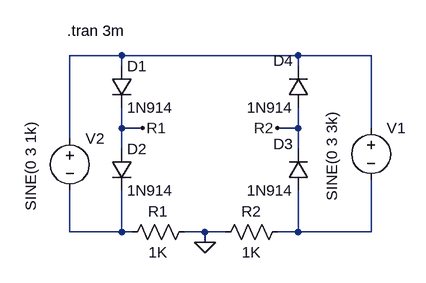
[diagram p0: schematic FullDuplex.asc]
FullDuplex.asc, the LTspice schematic file:
Version 4
SHEET 1 880 680
WIRE -128 208 -128 80
WIRE -128 352 -128 288
WIRE -48 80 -128 80
WIRE -48 96 -48 80
WIRE -48 192 -48 160
WIRE -48 224 -48 192
WIRE -48 352 -128 352
WIRE -48 352 -48 288
WIRE -32 352 -48 352
WIRE -16 192 -48 192
WIRE 80 352 48 352
WIRE 80 368 80 352
WIRE 112 352 80 352
WIRE 224 80 -48 80
WIRE 224 96 224 80
WIRE 224 192 192 192
WIRE 224 192 224 160
WIRE 224 224 224 192
WIRE 224 352 192 352
WIRE 224 352 224 288
WIRE 336 80 224 80
WIRE 336 192 336 80
WIRE 336 352 224 352
WIRE 336 352 336 272
FLAG 80 368 0
FLAG -16 192 R1
FLAG 192 192 R2
SYMBOL diode -64 96 R0
SYMATTR InstName D1
SYMATTR Value 1N914
SYMBOL diode -64 224 R0
SYMATTR InstName D2
SYMATTR Value 1N914
SYMBOL diode 240 288 R180
WINDOW 0 24 72 Left 0
WINDOW 3 24 0 Left 0
SYMATTR InstName D3
SYMATTR Value 1N914
SYMBOL diode 240 160 R180
WINDOW 0 24 72 Left 0
WINDOW 3 24 0 Left 0
SYMATTR InstName D4
SYMATTR Value 1N914
SYMBOL res 64 336 R90
WINDOW 0 0 56 VBottom 0
WINDOW 3 32 56 VTop 0
SYMATTR InstName R1
SYMATTR Value 1K
SYMATTR SpiceLine tol=1 pwr=0.1
SYMBOL res 208 336 R90
WINDOW 0 0 56 VBottom 0
WINDOW 3 32 56 VTop 0
SYMATTR InstName R2
SYMATTR Value 1K
SYMATTR SpiceLine tol=1 pwr=0.1
SYMBOL voltage 336 176 R0
WINDOW 3 -60 -10 VRight 0
WINDOW 123 0 0 Left 0
WINDOW 39 0 0 Left 0
SYMATTR InstName V1
SYMATTR Value SINE(0 3 3k)
SYMBOL voltage -128 192 R0
WINDOW 3 -60 -10 VRight 0
WINDOW 123 0 0 Left 0
WINDOW 39 0 0 Left 0
SYMATTR InstName V2
SYMATTR Value SINE(0 3 1k)
TEXT -132 42 Left 0 !.tran 3m

The netlist it stands for:
* FullDuplex.asc
D1 N001 R1 1N914
D2 R1 N002 1N914
D3 N003 R2 1N914
D4 R2 N001 1N914
R1 0 N002 1K tol=1 pwr=0.1
R2 N003 0 1K tol=1 pwr=0.1
V1 N001 N003 SINE(0 3 3k)
V2 N001 N002 SINE(0 3 1k)
.model D D
.lib standard.dio
.tran 3m
.backanno
.end